# EAGLE board loa_v2 (EAGLE 5.12)
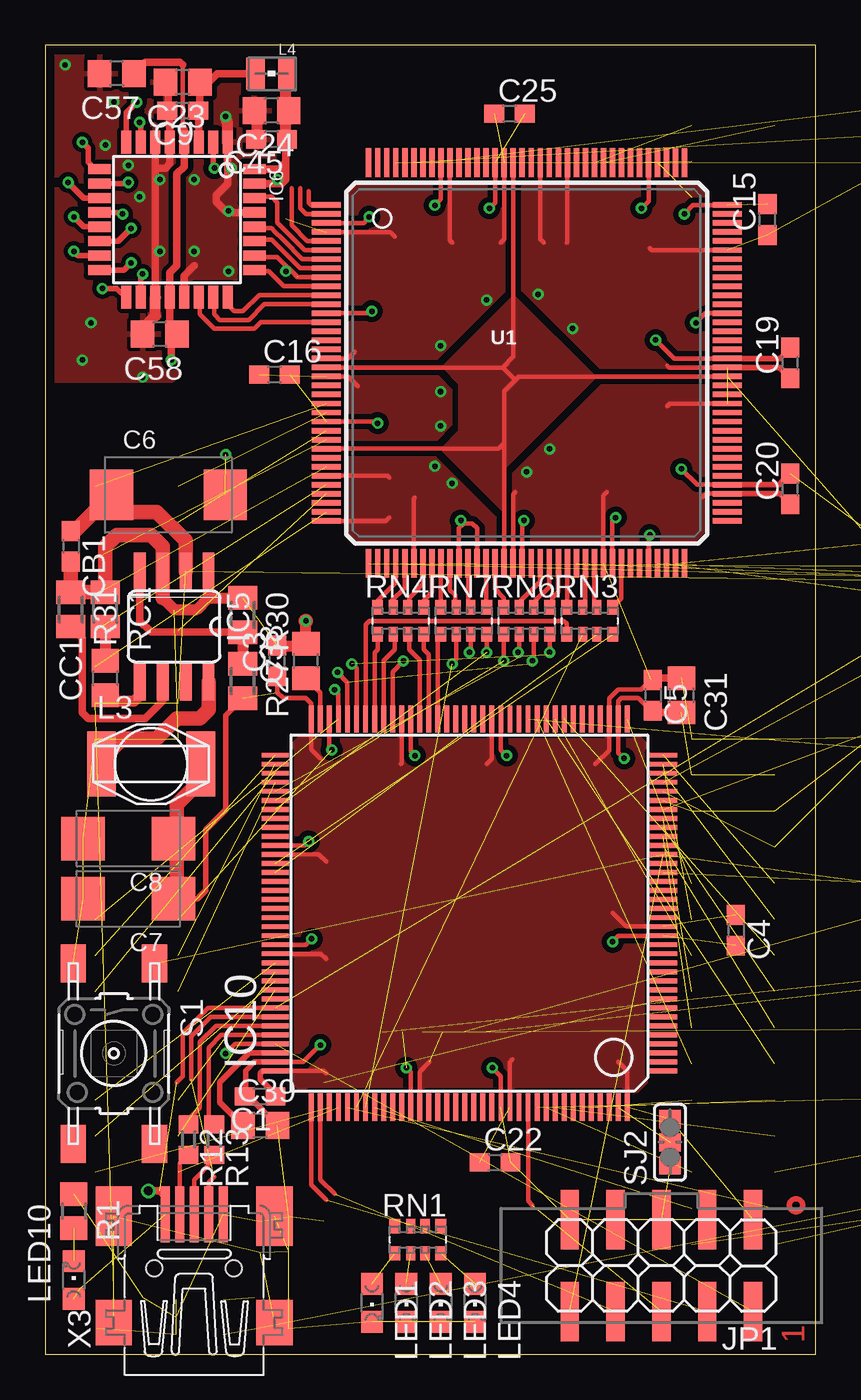
[diagram p9: board, top side]
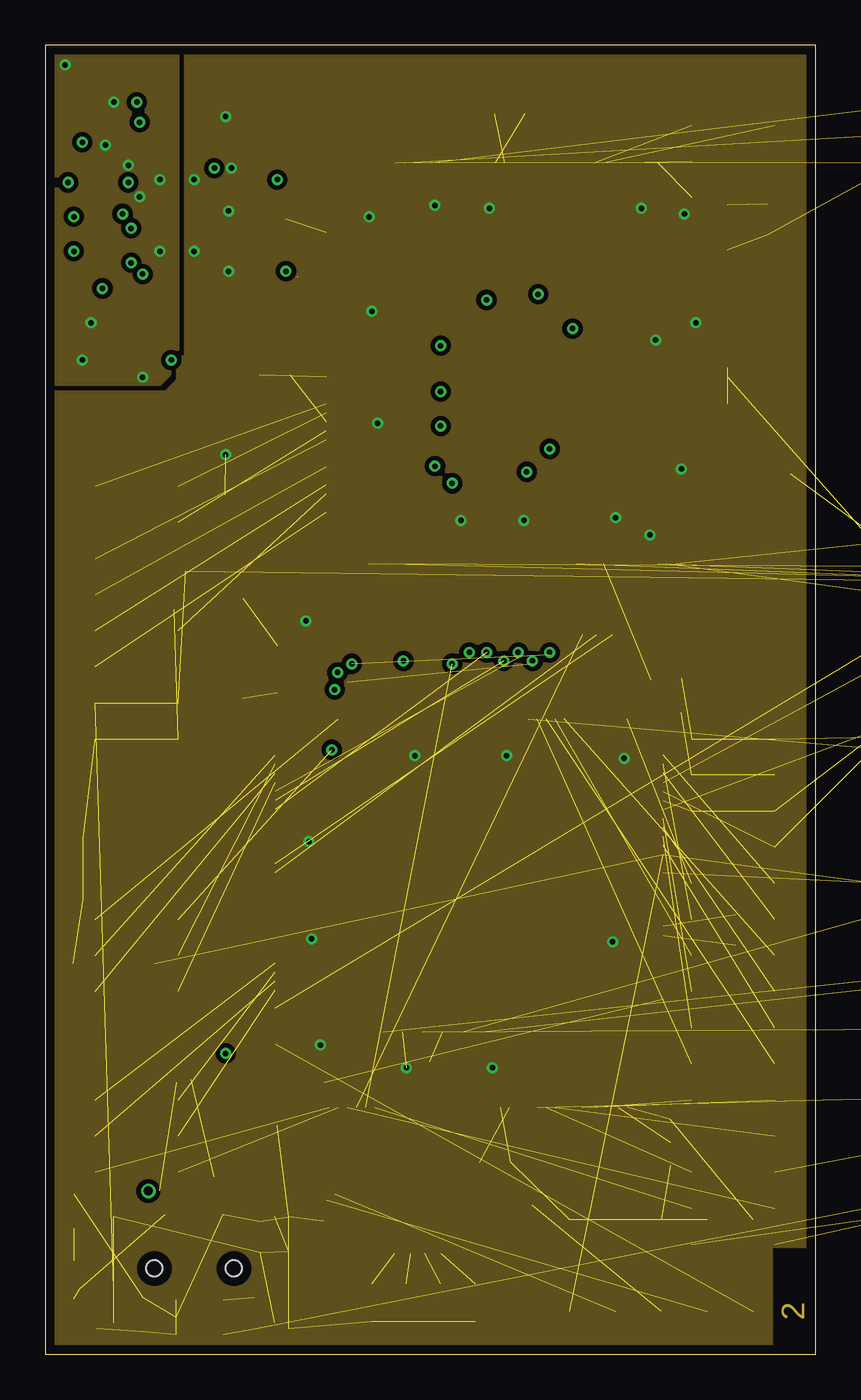
[diagram p10: board, inner layer GND]
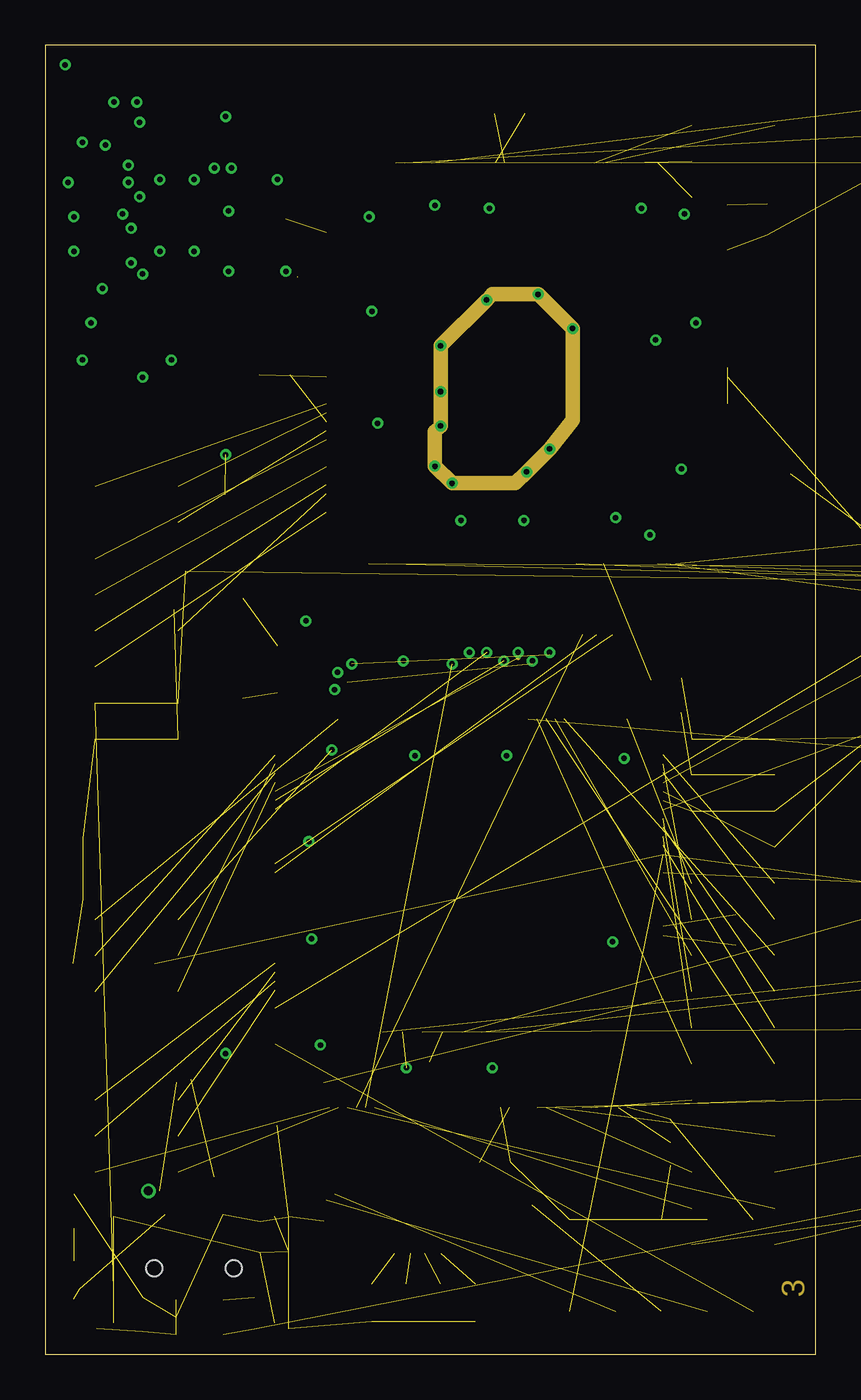
[diagram p11: board, inner layer Route15]
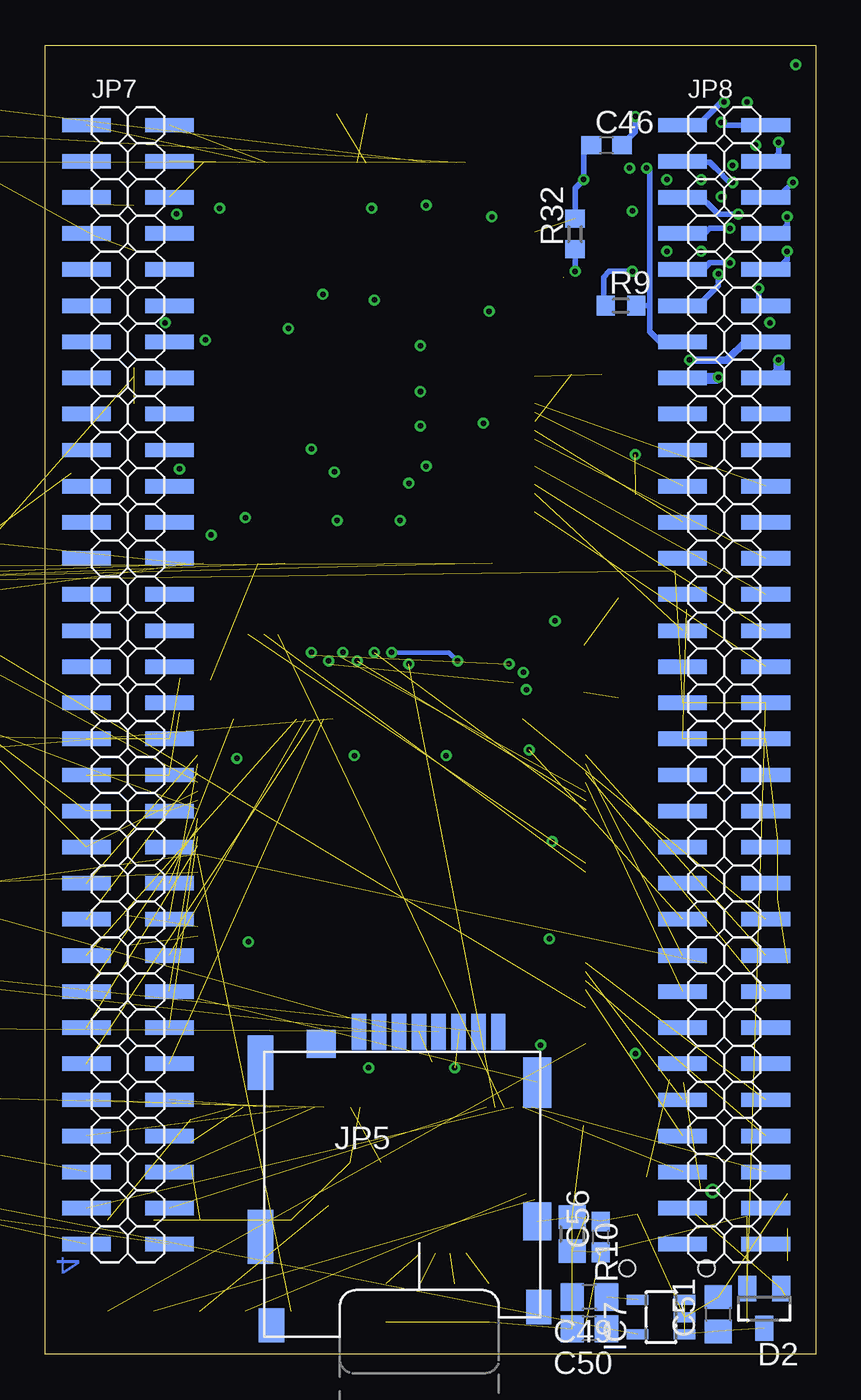
[diagram p12: board, bottom side, seen from below]

Size 42.68 x 72.54 mm. Coordinates in mm from the lower left corner, seen from the top.
Outline: 0,0 42.68,0 42.68,72.54 0,72.54 0,0
Copper layers (1+2*15+16): Top 0.035mm / dielectric 1.5mm / GND 0.035mm / dielectric 0.15mm / Route15 0.035mm / dielectric 0.2mm / Bottom 0.035mm
Design rules "PCB-POOL *": minimum track width 6mil, minimum drill 12mil, track to track 6mil, track to pad 6mil, pad to pad 6mil, via to via 6mil, smd to smd 6mil, copper to edge 20mil, drill to drill 8mil, minimum pad ring 8mil, minimum via ring 6mil, stop-mask expansion 12mil, vias tented up to drill 12mil, thermal gap 8mil

## Footprints (pad centres in the part's own frame; a part is rotated, then mirrored left to right if it is on the bottom)
C0603 = smd 1.1 x 1: 1 -0.85,0; 2 0.85,0
SMC_D = smd 2.4 x 2.8: + -3.15,0; - 3.15,0
SMC_C = smd 2.4 x 2.4: + -2.5,0; - 2.5,0
C0805 = smd 1.3 x 1.5: 1 -0.95,0; 2 0.95,0
SMB = smd 2.4 x 2.4: A 2.2,0; C -2.2,0
SOT23 = smd 1 x 1.4: 1 -0.95,-1.1; 2 0.95,-1.1; 3 0,1.1
SO14 = smd 0.66 x 2.032: 1 -3.81,-3.073; 2 -2.54,-3.073; 3 -1.27,-3.073; 4 0,-3.073; 5 1.27,-3.073; 6 2.54,-3.073; 7 3.81,-3.073; 8 3.81,3.073; 9 2.54,3.073; 10 1.27,3.073; 11 0,3.073; 12 -1.27,3.073; 13 -2.54,3.073; 14 -3.81,3.073
SO-08M = smd 0.6 x 2.2: 1 -1.905,-3.33; 2 -0.635,-3.33; 3 0.635,-3.33; 4 1.905,-3.33; 5 1.905,3.33; 6 0.635,3.33; 7 -0.635,3.33; 8 -1.905,3.33
SOT223 = smd 1.219 x 2.235: 1 -2.311,-3.099; 2 0,-3.099; 3 2.311,-3.099 | smd 3.6 x 2.2: 4 0,3.099
SO08 = smd 0.66 x 2.032: 1 -1.905,-3.073; 2 -0.635,-3.073; 3 0.635,-3.073; 4 1.905,-3.073; 5 1.905,3.073; 6 0.635,3.073; 7 -0.635,3.073; 8 -1.905,3.073
TQFP32-08 = smd 1.27 x 0.559: 1 -4.293,2.8; 2 -4.293,2; 3 -4.293,1.2; 4 -4.293,0.4; 5 -4.293,-0.4; 6 -4.293,-1.2; 7 -4.293,-2; 8 -4.293,-2.8; 17 4.293,-2.8; 18 4.293,-2; 19 4.293,-1.2; 20 4.293,-0.4; 21 4.293,0.4; 22 4.293,1.2; 23 4.293,2; 24 4.293,2.8 | smd 0.559 x 1.27: 9 -2.8,-4.293; 10 -2,-4.293; 11 -1.2,-4.293; 12 -0.4,-4.293; 13 0.4,-4.293; 14 1.2,-4.293; 15 2,-4.293; 16 2.8,-4.293; 25 2.8,4.293; 26 2,4.293; 27 1.2,4.293; 28 0.4,4.293; 29 -0.4,4.293; 30 -1.2,4.293; 31 -2,4.293; 32 -2.8,4.293
SOT23-5L = smd 0.55 x 1.2: 1 -0.95,-1.3; 2 0,-1.3; 3 0.95,-1.3; 4 0.95,1.3; 5 -0.95,1.3
SOIC-8 = smd 2.032 x 0.66: 1 -3.073,1.27; 2 -3.073,0; 3 -3.073,-1.27; 4 -3.073,-2.54; 5 3.073,-2.54; 6 3.073,-1.27; 7 3.073,0; 8 3.073,1.27
TQFP144 = smd 0.27 x 1.5: 1 -8.75,-10.75; 2 -8.25,-10.75; 3 -7.75,-10.75; 4 -7.25,-10.75; 5 -6.75,-10.75; 6 -6.25,-10.75; 7 -5.75,-10.75; 8 -5.25,-10.75; 9 -4.75,-10.75; 10 -4.25,-10.75; 11 -3.75,-10.75; 12 -3.25,-10.75; 13 -2.75,-10.75; 14 -2.25,-10.75; 15 -1.75,-10.75; 16 -1.25,-10.75; 17 -0.75,-10.75; 18 -0.25,-10.75; 19 0.25,-10.75; 20 0.75,-10.75; 21 1.25,-10.75; 22 1.75,-10.75; 23 2.25,-10.75; 24 2.75,-10.75; 25 3.25,-10.75; 26 3.75,-10.75; 27 4.25,-10.75; 28 4.75,-10.75; 29 5.25,-10.75; 30 5.75,-10.75; 31 6.25,-10.75; 32 6.75,-10.75; 33 7.25,-10.75; 34 7.75,-10.75; 35 8.25,-10.75; 36 8.75,-10.75; 73 8.75,10.75; 74 8.25,10.75; 75 7.75,10.75; 76 7.25,10.75; 77 6.75,10.75; 78 6.25,10.75; 79 5.75,10.75; 80 5.25,10.75; 81 4.75,10.75; 82 4.25,10.75; 83 3.75,10.75; 84 3.25,10.75; 85 2.75,10.75; 86 2.25,10.75; 87 1.75,10.75; 88 1.25,10.75; 89 0.75,10.75; 90 0.25,10.75; 91 -0.25,10.75; 92 -0.75,10.75; 93 -1.25,10.75; 94 -1.75,10.75; 95 -2.25,10.75; 96 -2.75,10.75; 97 -3.25,10.75; 98 -3.75,10.75; 99 -4.25,10.75; 100 -4.75,10.75; 101 -5.25,10.75; 102 -5.75,10.75; 103 -6.25,10.75; 104 -6.75,10.75; 105 -7.25,10.75; 106 -7.75,10.75; 107 -8.25,10.75; 108 -8.75,10.75 | smd 1.5 x 0.27: 37 10.75,-8.75; 38 10.75,-8.25; 39 10.75,-7.75; 40 10.75,-7.25; 41 10.75,-6.75; 42 10.75,-6.25; 43 10.75,-5.75; 44 10.75,-5.25; 45 10.75,-4.75; 46 10.75,-4.25; 47 10.75,-3.75; 48 10.75,-3.25; 49 10.75,-2.75; 50 10.75,-2.25; 51 10.75,-1.75; 52 10.75,-1.25; 53 10.75,-0.75; 54 10.75,-0.25; 55 10.75,0.25; 56 10.75,0.75; 57 10.75,1.25; 58 10.75,1.75; 59 10.75,2.25; 60 10.75,2.75; 61 10.75,3.25; 62 10.75,3.75; 63 10.75,4.25; 64 10.75,4.75; 65 10.75,5.25; 66 10.75,5.75; 67 10.75,6.25; 68 10.75,6.75; 69 10.75,7.25; 70 10.75,7.75; 71 10.75,8.25; 72 10.75,8.75; 109 -10.75,8.75; 110 -10.75,8.25; 111 -10.75,7.75; 112 -10.75,7.25; 113 -10.75,6.75; 114 -10.75,6.25; 115 -10.75,5.75; 116 -10.75,5.25; 117 -10.75,4.75; 118 -10.75,4.25; 119 -10.75,3.75; 120 -10.75,3.25; 121 -10.75,2.75; 122 -10.75,2.25; 123 -10.75,1.75; 124 -10.75,1.25; 125 -10.75,0.75; 126 -10.75,0.25; 127 -10.75,-0.25; 128 -10.75,-0.75; 129 -10.75,-1.25; 130 -10.75,-1.75; 131 -10.75,-2.25; 132 -10.75,-2.75; 133 -10.75,-3.25; 134 -10.75,-3.75; 135 -10.75,-4.25; 136 -10.75,-4.75; 137 -10.75,-5.25; 138 -10.75,-5.75; 139 -10.75,-6.25; 140 -10.75,-6.75; 141 -10.75,-7.25; 142 -10.75,-7.75; 143 -10.75,-8.25; 144 -10.75,-8.75
2X05SMD = smd 1.016 x 3.302: 1 -5.08,-2.54; 2 -5.08,2.54; 3 -2.54,-2.54; 4 -2.54,2.54; 5 0,-2.54; 6 0,2.54; 7 2.54,-2.54; 8 2.54,2.54; 9 5.08,-2.54; 10 5.08,2.54
SD_MOLEX_49225-0821 = smd 0.8 x 2: 1 -2.43,8.5; 2 -1.33,8.5; 3 -0.23,8.5; 4 0.87,8.5; 5 1.97,8.5; 6 3.07,8.5; 7 4.17,8.5; 8 5.27,8.5 | smd 1.4 x 1.9: 11 7.51,-6.75; 12 -7.29,-7.75 | smd 1.4 x 3: 13 -7.89,-2.85; 14 -7.89,6.8 | smd 1.6 x 1.55: 15 -4.53,7.825 | smd 1.55 x 2.8: SW1 7.435,5.7 | smd 1.55 x 2.1: SW2 7.435,-2
2X32M_SMD = smd 0.8 x 2.7: 1 -30,-2.3; 2 -30,2.3; 3 -28,-2.3; 4 -28,2.3; 5 -26,-2.3; 6 -26,2.3; 7 -24,-2.3; 8 -24,2.3; 9 -22,-2.3; 10 -22,2.3; 11 -20,-2.3; 12 -20,2.3; 13 -18,-2.3; 14 -18,2.3; 15 -16,-2.3; 16 -16,2.3; 17 -14,-2.3; 18 -14,2.3; 19 -12,-2.3; 20 -12,2.3; 21 -10,-2.3; 22 -10,2.3; 23 -8,-2.3; 24 -8,2.3; 25 -6,-2.3; 26 -6,2.3; 27 -4,-2.3; 28 -4,2.3; 29 -2,-2.3; 30 -2,2.3; 31 0,-2.3; 32 0,2.3; 33 2,-2.3; 34 2,2.3; 35 4,-2.3; 36 4,2.3; 37 6,-2.3; 38 6,2.3; 39 8,-2.3; 40 8,2.3; 41 10,-2.3; 42 10,2.3; 43 12,-2.3; 44 12,2.3; 45 14,-2.3; 46 14,2.3; 47 16,-2.3; 48 16,2.3; 49 18,-2.3; 50 18,2.3; 51 20,-2.3; 52 20,2.3; 53 22,-2.3; 54 22,2.3; 55 24,-2.3; 56 24,2.3; 57 26,-2.3; 58 26,2.3; 59 28,-2.3; 60 28,2.3; 61 30,-2.3; 62 30,2.3; 63 32,-2.3; 64 32,2.3
WE-KI_0805_B = smd 1.02 x 1.78: 1 -0.89,0; 2 0.89,0
L-PISG = smd 1.6 x 3.6: 1 -2.75,0; 2 2.75,0
CHIPLED_0805 = smd 1.2 x 1.2: A 0,-1.05; C 0,1.05
XO53 = smd 1.93 x 2.032: 1 -1.5,-1.7; 2 1.5,-1.7; 3 1.5,1.7; 4 -1.5,1.7
R0805 = smd 1.3 x 1.5: 1 -0.95,0; 2 0.95,0
R0603 = smd 1 x 1.1: 1 -0.85,0; 2 0.85,0
M0805 = smd 1.3 x 1.6: 1 -0.95,0; 2 0.95,0
EXB38V = smd 0.6 x 0.8: 1 -1.275,-0.75; 4 1.275,-0.75; 5 1.275,0.75; 8 -1.275,0.75 | smd 0.5 x 0.8: 2 -0.4,-0.75; 3 0.4,-0.75; 6 0.4,0.75; 7 -0.4,0.75
B3F-10XX-SMD = smd 2.1 x 1.4: P1 -5,2.25; P2 5,2.25; P3 -5,-2.25; P4 5,-2.25
SJ_2S = smd 1 x 1.2: 1 -1.286,0; 2 0,0; 3 1.286,0
SJS = smd 1 x 1.2: 1 -0.683,0; 2 0.683,0
TQ144 = smd 1.6 x 0.3: P1 -11.1,8.75; P2 -11.1,8.25; P3 -11.1,7.75; P4 -11.1,7.25; P5 -11.1,6.75; P6 -11.1,6.25; P7 -11.1,5.75; P8 -11.1,5.25; P9 -11.1,4.75; P10 -11.1,4.25; P11 -11.1,3.75; P12 -11.1,3.25; P13 -11.1,2.75; P14 -11.1,2.25; P15 -11.1,1.75; P16 -11.1,1.25; P17 -11.1,0.75; P18 -11.1,0.25; P19 -11.1,-0.25; P20 -11.1,-0.75; P21 -11.1,-1.25; P22 -11.1,-1.75; P23 -11.1,-2.25; P24 -11.1,-2.75; P25 -11.1,-3.25; P26 -11.1,-3.75; P27 -11.1,-4.25; P28 -11.1,-4.75; P29 -11.1,-5.25; P30 -11.1,-5.75; P31 -11.1,-6.25; P32 -11.1,-6.75; P33 -11.1,-7.25; P34 -11.1,-7.75; P35 -11.1,-8.25; P36 -11.1,-8.75; P73 11.1,-8.75; P74 11.1,-8.25; P75 11.1,-7.75; P76 11.1,-7.25; P77 11.1,-6.75; P78 11.1,-6.25; P79 11.1,-5.75; P80 11.1,-5.25; P81 11.1,-4.75; P82 11.1,-4.25; P83 11.1,-3.75; P84 11.1,-3.25; P85 11.1,-2.75; P86 11.1,-2.25; P87 11.1,-1.75; P88 11.1,-1.25; P89 11.1,-0.75; P90 11.1,-0.25; P91 11.1,0.25; P92 11.1,0.75; P93 11.1,1.25; P94 11.1,1.75; P95 11.1,2.25; P96 11.1,2.75; P97 11.1,3.25; P98 11.1,3.75; P99 11.1,4.25; P100 11.1,4.75; P101 11.1,5.25; P102 11.1,5.75; P103 11.1,6.25; P104 11.1,6.75; P105 11.1,7.25; P106 11.1,7.75; P107 11.1,8.25; P108 11.1,8.75 | smd 0.3 x 1.6: P37 -8.75,-11.1; P38 -8.25,-11.1; P39 -7.75,-11.1; P40 -7.25,-11.1; P41 -6.75,-11.1; P42 -6.25,-11.1; P43 -5.75,-11.1; P44 -5.25,-11.1; P45 -4.75,-11.1; P46 -4.25,-11.1; P47 -3.75,-11.1; P48 -3.25,-11.1; P49 -2.75,-11.1; P50 -2.25,-11.1; P51 -1.75,-11.1; P52 -1.25,-11.1; P53 -0.75,-11.1; P54 -0.25,-11.1; P55 0.25,-11.1; P56 0.75,-11.1; P57 1.25,-11.1; P58 1.75,-11.1; P59 2.25,-11.1; P60 2.75,-11.1; P61 3.25,-11.1; P62 3.75,-11.1; P63 4.25,-11.1; P64 4.75,-11.1; P65 5.25,-11.1; P66 5.75,-11.1; P67 6.25,-11.1; P68 6.75,-11.1; P69 7.25,-11.1; P70 7.75,-11.1; P71 8.25,-11.1; P72 8.75,-11.1; P109 8.75,11.1; P110 8.25,11.1; P111 7.75,11.1; P112 7.25,11.1; P113 6.75,11.1; P114 6.25,11.1; P115 5.75,11.1; P116 5.25,11.1; P117 4.75,11.1; P118 4.25,11.1; P119 3.75,11.1; P120 3.25,11.1; P121 2.75,11.1; P122 2.25,11.1; P123 1.75,11.1; P124 1.25,11.1; P125 0.75,11.1; P126 0.25,11.1; P127 -0.25,11.1; P128 -0.75,11.1; P129 -1.25,11.1; P130 -1.75,11.1; P131 -2.25,11.1; P132 -2.75,11.1; P133 -3.25,11.1; P134 -3.75,11.1; P135 -4.25,11.1; P136 -4.75,11.1; P137 -5.25,11.1; P138 -5.75,11.1; P139 -6.25,11.1; P140 -6.75,11.1; P141 -7.25,11.1; P142 -7.75,11.1; P143 -8.25,11.1; P144 -8.75,11.1
32005-201 = smd 3.1 x 0.5: 1 3,1.6; 2 3,0.8; 3 3,0; 4 3,-0.8; 5 3,-1.6 | smd 2.5 x 2: M1 -3,-4.45; M2 -3,4.45 | smd 3.3 x 2: M3 2.9,4.45; M4 2.9,-4.45 | hole 0.9: 0,2.2; 0,-2.2

## Placement (x,y rotation side)
C1  100n  [C0603]  11.91,14.29 180 top
C2  100n  [C0603]  54.93,30.32 270 top  (outside the outline)
C3  100n  [C0603]  12.86,38.42 90 top
C4  100n  [C0603]  38.26,23.49 270 top
C5  100n  [C0603]  33.66,36.51 270 top
C6  22µ  [SMC_D]  6.83,47.62 0 top
C7  22µ  [SMC_C]  4.6,25.24 180 top
C8  22µ  [SMC_C]  4.6,28.57 180 top
C9  100n  [C0603]  7.62,68.9 180 top
C10  10n  [C0603]  48.74,42.7 0 top  (outside the outline)
C11  10n  [C0603]  66.04,65.25 0 top  (outside the outline)
C12  10n  [C0603]  58.1,64.93 180 top  (outside the outline)
C13  10n  [C0603]  58.42,43.18 180 top  (outside the outline)
C14  100n  [C0603]  75.09,48.1 45 top  (outside the outline)
C15  100n  [C0603]  40.01,62.87 90 top
C16  100n  [C0603]  12.7,54.29 0 top
C17  100n  [C0603]  75.98,59.15 315 top  (outside the outline)
C18  100n  [C0603]  63.82,59.05 225 top  (outside the outline)
C19  100n  [C0603]  41.27,54.93 90 top
C20  100n  [C0603]  41.27,47.94 90 top
C21  100n  [C0603]  64.55,47.85 135 top  (outside the outline)
C22  100n  [C0603]  24.92,10.64 0 top
C23  1µ  [C0805]  7.62,70.48 180 top
C24  1µ  [C0805]  12.54,68.9 180 top
C25  100n  [C0603]  25.72,68.74 0 top
C26  100n  [C0603]  70.01,47.62 90 top  (outside the outline)
C27  100n  [C0603]  58.1,66.2 180 top  (outside the outline)
C28  100n  [C0603]  66.04,66.52 0 top  (outside the outline)
C29  100n  [C0603]  58.42,40.64 180 top  (outside the outline)
C30  100n  [C0603]  48.74,41.43 0 top  (outside the outline)
C31  4u7  [C0805]  35.24,36.51 270 top
C32  1n  [C0603]  47.62,38.1 270 top  (outside the outline)
C33  100n  [C0603]  56.36,11.11 90 top  (outside the outline)
C34  100n  [C0805]  87.63,13.18 0 top  (outside the outline)
C35  1µ  [C0805]  49.37,38.26 270 top  (outside the outline)
C36  1n  [C0603]  51.28,38.1 270 top  (outside the outline)
C37  1µ  [C0805]  53.98,39.05 0 top  (outside the outline)
C38  2u2  [C0805]  14.45,38.42 90 top
C39  2u2  [C0805]  11.91,12.7 0 top
C44  100n  [C0603]  51.28,34.29 0 top  (outside the outline)
C45  100n  [C0603]  12.54,67.31 180 top
C46  100n  [C0603]  11.59,66.99 0 bottom
C47  4µ7  [C0805]  73.34,42.39 270 bottom  (outside the outline)
C48  1µ  [C0805]  73.34,38.97 90 bottom  (outside the outline)
C49  N.B.  [C0805]  12.54,3.17 180 bottom
C50  2µ2  [C0805]  12.54,1.43 180 bottom
C51  1µ  [C0805]  5.4,2.22 90 bottom
C52  22µ  [SMC_C]  67.31,27.15 0 bottom  (outside the outline)
C53  22µ  [SMC_C]  72.87,33.18 90 bottom  (outside the outline)
C54  100n  [C0603]  66.99,24.61 0 bottom  (outside the outline)
C55  100n  [C0603]  66.99,23.34 0 bottom  (outside the outline)
C56  10n  [C0603]  11.91,6.51 90 bottom
C57  470n  [C0805]  3.97,70.96 180 top
C58  470n  [C0805]  6.35,56.51 180 top
CB1  100n  [C0603]  1.43,44.77 270 top
CC1  6n8  [C0805]  3.33,37.47 90 top
D1  MURS 140  [SMB]  59.21,44.93 90 bottom  (outside the outline)
D2  BAT54C  [SOT23]  2.86,2.54 180 bottom
IC2  74AC02D  [SO14]  86.68,40.96 90 bottom  (outside the outline)
IC3  AT45DB081D-SU  [SO-08M]  87,21.59 0 top  (outside the outline)
IC4  MCP1825S-1202E/DB  [SOT223]  67.94,40.64 270 bottom  (outside the outline)
IC5  NCP3170  [SO08]  7.14,40.32 180 top
IC6  AD7266SU  [TQFP32-08]  7.3,62.87 270 top
IC7  MIC5205  [SOT23-5L]  8.57,2.06 90 bottom
IC8  MCP2551SN  [SOIC-8]  61.28,11.43 0 top  (outside the outline)
IC10  [TQFP144]  23.5,24.45 90 top
JP1  CORTEX_JTAGS  [2X05SMD]  34.13,4.92 180 top
JP5  SD_DETECT  [SD_MOLEX_49225-0821]  22.86,9.37 0 bottom
JP7  right  [2X32M_SMD]  38.1,38.1 270 bottom
JP8  left  [2X32M_SMD]  5.08,38.1 270 bottom
L1  0,68u  [WE-KI_0805_B]  54.93,43.81 270 top  (outside the outline)
L3  4µ7  [L-PISG]  5.87,32.7 0 top
L4  0,68u  [WE-KI_0805_B]  12.54,70.96 180 top
LED1  Red  [CHIPLED_0805]  18.1,2.86 180 top
LED2  Red  [CHIPLED_0805]  20,2.86 180 top
LED3  Red  [CHIPLED_0805]  21.91,2.86 180 top
LED4  Red  [CHIPLED_0805]  23.81,2.86 180 top
LED5  Red  [CHIPLED_0805]  48.42,66.04 270 top  (outside the outline)
LED6  Red  [CHIPLED_0805]  48.42,67.94 270 top  (outside the outline)
LED7  Red  [CHIPLED_0805]  48.42,69.85 270 top  (outside the outline)
LED8  Red  [CHIPLED_0805]  48.42,71.75 270 top  (outside the outline)
LED9  Green  [CHIPLED_0805]  81.6,39.05 180 top  (outside the outline)
LED10  Blue  [CHIPLED_0805]  1.59,4.13 0 top
LED11  Red  [CHIPLED_0805]  80.01,55.88 0 top  (outside the outline)
LED12  Green  [CHIPLED_0805]  87.63,55.88 0 top  (outside the outline)
Q1  25.000  [XO53]  75.56,26.35 180 bottom  (outside the outline)
Q2  50.000  [XO53]  57.78,69.85 270 top  (outside the outline)
R1  820  [R0805]  1.59,7.94 270 top
R2  100k  [R0805]  66.52,31.75 180 bottom  (outside the outline)
R4  10k  [R0805]  78.11,21.91 180 bottom  (outside the outline)
R5  10k  [R0603]  77.47,41.91 0 top  (outside the outline)
R6  10k  [R0603]  82.55,41.91 0 top  (outside the outline)
R7  10k  [R0603]  87.63,41.91 0 top  (outside the outline)
R8  10k  [R0603]  92.71,41.91 0 top  (outside the outline)
R9  10k  [R0603]  10.79,58.1 0 bottom
R10  1M  [R0805]  13.49,6.67 270 bottom
R11  330  [R0603]  90.17,49.53 0 top  (outside the outline)
R12  22  [R0603]  7.94,11.91 270 top
R13  22  [R0603]  9.37,11.91 270 top
R18  470  [R0805]  51.91,66.04 180 top  (outside the outline)
R19  470  [R0805]  51.91,67.94 180 top  (outside the outline)
R20  470  [R0805]  51.91,69.85 180 top  (outside the outline)
R21  470  [R0805]  51.91,71.75 180 top  (outside the outline)
R22  330  [R0805]  83.5,39.05 90 top  (outside the outline)
R23  470  [R0805]  66.67,11.43 90 top  (outside the outline)
R24  330  [R0603]  64.77,41.91 0 top  (outside the outline)
R25  330  [R0603]  71.12,41.91 0 top  (outside the outline)
R26  10k  [M0805]  66.52,29.84 180 bottom  (outside the outline)
R27  24k9  [M0805]  10.95,37.31 270 top
R28  10k  [M0805]  71.12,23.18 0 bottom  (outside the outline)
R29  10k  [M0805]  87.63,15.08 180 top  (outside the outline)
R30  8k06  [M0805]  10.95,40.96 270 top
R31  10k  [M0805]  1.43,41.27 270 top
R32  10k  [R0603]  13.34,62.07 90 bottom
R33  120  [R0805]  63.02,14.61 0 top  (outside the outline)
RC1  4k99  [M0805]  3.33,41.27 270 top
RN1  33  [EXB38V]  20.64,6.35 0 top
RN3  33  [EXB38V]  30.16,40.64 0 top
RN4  33  [EXB38V]  19.68,40.64 0 top
RN6  33  [EXB38V]  26.67,40.64 0 top
RN7  33  [EXB38V]  23.18,40.64 0 top
S1  Reset  [B3F-10XX-SMD]  3.81,16.67 270 top
SJ2  [SJ_2S]  34.61,11.75 90 top
SJ3  [SJ_2S]  49.05,35.72 0 top  (outside the outline)
SJ5  [SJS]  80.8,32.86 270 bottom  (outside the outline)
U1  6SLX9TQG144  [TQ144]  26.67,54.93 0 top
U$1  [LOGO]  3.17,78.42 0 top  (outside the outline)
X3  MINI-USB  [32005-201]  8.25,4.76 90 top

## Tracks (layer width: path | path; a pad name or v marks a point on that pad's centre or on a via)
!ADC_CS  (via drill 0.3)  (1 unrouted)
  Top 0.254: U1.P9 13.98,59.68 12.86,60.8 11.66,60.8 IC6.26 | v13.34,60.01 13.65,60.01 | 13.65,60.01 | 13.65,60.01 13.97,59.69
  Bottom 0.305: v13.34,60.01 13.34,60.64 R32.1
!RESET  (3 unrouted)
+3V3  (via drill 0.3)  (50 unrouted)
  Top 0.254: U1.P20 16.78,54.18 17.3,53.66 | U1.P18 16.76,55.18 17.14,55.56 | U1.P4 19.1,62.18 19.37,61.91 | U1.P135 22.42,61.72 22.54,61.59 | U1.P129 25.42,61.77 25.24,61.59 | U1.P125 27.42,61.8 27.62,61.59 | U1.P122 28.92,61.62 28.89,61.59 | U1.P103 33.6,61.18 33.5,61.28 | U1.P76 36.62,47.68 36.35,47.47 | U1.P86 34.58,52.68 34.45,52.55 | U1.P90 34.54,54.68 34.45,54.77 | U1.P63 30.92,47.59 31.11,47.78 | U1.P53 25.92,47.67 26.04,47.78 | U1.P42 20.42,47.41 20.48,47.47 | U1.P36 18.87,46.18 19.05,46.35 | U1.P31 18.95,48.68 19.05,48.58 | IC10.62 19.75,32.76 19.68,32.7 | IC10.52 24.75,33 24.45,32.7 | 30.48,32.7 31.25,33.47 IC10.39 31.25,36.33 31.75,36.83 33.02,36.83 33.55,37.36 C5.1 | IC10.108 15.42,15.7 15.56,15.56 | IC10.95 15.27,22.2 15.56,21.91 | IC10.121 20.75,15.66 21.27,16.19 | IC10.131 25.75,16.16 25.88,16.35 | IC10.144 32.24,15.7 31.75,16.19 | IC10.84 15.16,27.7 15.56,27.3 | IC10.17 32.18,23.7 31.43,24.45 | 15.24,33.02 14.74,33.52 IC10.72 14.74,36.05 14.45,36.35 13.18,36.35 12.86,36.67 12.86,37.41 C3.1
  Top 0.305: C7.+ 8.41,25.24 8.89,25.72 8.89,29.05 10,30.16 10,35.4 R27.2 | C1.1 12.7,14.61 12.54,14.61 | 12.54,14.61 11.91,15.24 11.91,15.56 12.05,15.7 IC10.108 | 12.54,14.61 | U1.P76 40.69,47.68 C20.1 | U1.P90 40.67,54.68 C19.1 | IC6.31 12.64,64.86 v12.86,65.09
  Top 0.406: IC6.31 13.11,64.86 13.34,65.09 13.34,65.61 13.28,65.67 13.34,65.72 13.34,66.04 | 13.34,66.04 13.34,67.25 C45.1 | IC6.32 12.96,65.67 13.34,66.04 | C5.1 33.71,37.36 33.81,37.47 C31.1
  Top 0.61: 13.34,69.05 13.34,67.47 C45.1 13.34,67.41 | 13.34,69.05 C24.1 13.34,69.05 | 13.34,69.05 13.34,70.84
  Top 0.813: L3.2 8.62,31.8 7.3,30.48 7.3,28.46 C8.+ 7.3,28.26 7.3,25.12 C7.+ | 13.34,70.84 L4.1
  Route15 0.813: v21.91,51.44 v21.91,53.34 v21.91,55.88 v24.45,58.42 24.77,58.74 v27.3,58.74 v29.21,56.83 29.21,51.75 v27.94,50.16 v26.67,48.9 26.04,48.26 v22.54,48.26 v21.59,49.21 21.59,51.12 v21.91,51.44
  Bottom 0.305: R32.2 13.34,64.61 v12.86,65.09 12.86,66.52 12.44,66.94 C46.1
  pour Top (isolate 0.305, rank 6): 17.46,45.09 16.83,45.72 16.83,64.14 17.46,64.77 35.88,64.77 36.51,64.14 36.51,45.72 35.88,45.09
  pour Top (isolate 0.305): 14.29,14.61 13.65,15.24 13.65,33.66 14.29,34.29 32.7,34.29 33.34,33.66 33.34,15.24 32.7,14.61
+5V  (3 unrouted)
ADC_A0
  Top 0.254: U1.P10 13.21,59.18 12.38,60.01 11.91,60.01 11.85,60.06 IC6.25
ADC_A1
  Top 0.254: U1.P11 11.85,58.68 10.95,57.78 10.48,57.78 10.16,58.1 10.16,58.52 IC6.24
ADC_A2
  Top 0.254: U1.P12 12.14,58.18 11.27,57.31 9.68,57.31 9.37,57.63 9.37,58.51 IC6.23
ADC_CLK
  Top 0.254: U1.P8 14.12,60.18 12.54,61.75 11.68,61.75 IC6.27
ADC_DOUTA
  Top 0.254: U1.P6 14.39,61.18 12.86,62.71 12.86,63.82 12.54,64.14 11.66,64.14 IC6.30
ADC_DOUTB
  Top 0.254: U1.P7 14.25,60.68 13.18,61.75 12.7,62.23 12.54,62.39 11.68,62.39 IC6.28
ADC_SGL_DIFF
  Top 0.254: U1.P14 11.93,57.18 11.59,56.83 9.37,56.83 8.57,57.63 8.57,58.5 IC6.22
AGND  (via drill 0.3)
  Top 0.406: IC6.19 IC6.6 6.11,67.11 6.11,65.72 6.67,65.72 6.9,65.96 IC6.5 6.9,68.77 C9.2 6.83,68.9 6.83,70.33 C23.2
  Top 0.61: IC6.19 6.1,57.54 5.4,56.83 | C58.2 5.4,56.83 | 5.4,56.83 5.56,56.84
  Bottom 0.61: JP8.15 5.43,54.1 v5.4,54.13 | JP8.16 2.42,54.1 2.06,54.45 v2.06,55.09
  other vias: 4.6,65.88 6.35,61.12 6.35,65.09 2.54,57.15 3.33,66.99 1.11,71.44 3.81,69.37 5.24,64.14
  pour Top (isolate 0.254, rank 5): -1.27,73.34 7.3,73.34 7.3,54.29 6.99,53.98 -1.27,53.98
  pour GND (isolate 0.254, rank 5): -1.91,74.3 7.3,74.3 7.3,54.77 6.35,53.82 -1.91,53.82
CAN-H  (1 unrouted)
CAN-L  (1 unrouted)
CCLK  (1 unrouted)
D0  (1 unrouted)
D1  (1 unrouted)
D2  (1 unrouted)
D3  (via drill 0.3)  (1 unrouted)
  Top 0.254: RN7.2 22.78,38.5 v22.54,38.26
D4
  Top 0.254: IC10.58 21.75,39.73 RN7.1
D5
  Top 0.254: IC10.59 21.25,38.76 20.95,39.05 RN4.4
  Top 0.305: RN4.4
D6
  Top 0.254: IC10.60 20.75,38.47 20.16,39.05 20.16,39.81
  Top 0.305: 20.16,39.81 RN4.3
D7  (via drill 0.3)
  Top 0.254: IC10.63 19.25,37.82 v19.84,38.42 | RN7.3 23.58,38.98 v23.5,38.89
  Bottom 0.254: v23.5,38.89 20.32,38.89 v19.84,38.42
D8
  Top 0.254: IC10.64 18.75,38.43 19.37,39.05 19.37,39.81
  Top 0.305: 19.37,39.81 RN4.2
D9
  Top 0.254: IC10.65 18.25,38.88 18.41,39.05 RN4.1
  Top 0.305: RN4.1
D10
  Top 0.254: IC10.66 17.75,40.45 17.94,40.64 28.73,40.64 28.89,40.48 RN3.1
D11  (via drill 0.3)  (1 unrouted)
  Top 0.254: IC10.67 17.25,38 v16.99,38.26 | RN6.4 27.95,39.06 v27.94,38.89
  Route15 0.254: v27.94,38.89 27.94,38.73
D12  (via drill 0.3)  (1 unrouted)
  Top 0.254: IC10.68 16.75,37.23 v16.19,37.78 | RN6.3 27.07,38.5 v26.99,38.42
  Route15 0.254: v26.99,38.42 26.99,38.26
D13  (via drill 0.3)  (1 unrouted)
  Top 0.254: RN6.2 26.27,39.13 v26.19,38.89
  Route15 0.254: v26.19,38.89 26.19,38.58
D14  (via drill 0.3)  (1 unrouted)
  Top 0.254: RN6.1 25.39,39.06 v25.4,38.42
D15  (via drill 0.3)  (1 unrouted)
  Top 0.254: RN7.4 24.45,39.22 v24.45,38.89
DONE  (3 unrouted)
FLASH_CS  (1 unrouted)
GND  (via drill 0.3)  (69 unrouted)
  Top 0.254: U1.P25 18.33,51.68 v18.41,51.59 | U1.P13 17.99,57.68 v18.1,57.78 | U1.P3 17.65,62.68 v17.94,63.02 | U1.P136 21.92,63.99 v21.59,63.66 | U1.P130 24.92,63.81 v24.61,63.5 | U1.P113 33.42,63.9 v33.02,63.5 | U1.P108 35.86,63.68 v35.4,63.18 | U1.P96 36.56,57.68 v36.04,57.15 | U1.P91 34.83,55.18 v33.81,56.2 | v33.81,56.2 | U1.P77 36.12,48.18 v35.24,49.05 | U1.P68 33.42,45.33 v33.5,45.4 | U1.P64 31.42,46.18 v31.59,46.35 | U1.P54 26.42,46.1 v26.51,46.2 | U1.P49 23.92,45.77 23.65,46.04 23.18,46.04 | U1.P47 22.92,45.78 23.18,46.04 | 23.18,46.04 | 23.18,46.04 v23.02,46.2 | IC10.83 14.39,28.2 v14.61,28.42 | IC10.94 14.44,22.7 v14.76,23.02 | IC10.61 20.25,33.41 v20.48,33.18 | IC10.51 25.25,33.49 v25.56,33.18 | v32.07,33.02 31.75,33.33 IC10.38 31.75,36.2 31.91,36.35 32.86,36.35 33.55,35.66 C5.2 | IC10.16 31.73,23.2 v31.43,22.86 | IC10.120 20.25,15.64 v20,15.88 | IC10.107 14.28,16.2 v15.24,17.14 | IC10.130 25.25,15.39 v24.77,15.88
  Top 0.305: IC10.107 11.59,16.2 11.11,15.72 11.11,14.66 C1.2 11.27,14.29 C39.2 | U1.P77 40.66,48.18 C20.2 | U1.P91 40.67,55.18 C19.2
  Top 0.406: IC6.29 10.08,63.27 9.47,63.88 9.47,64.24 10.1,64.87 IC6.1 | IC6.21 7.7,59.77 8.26,60.33 | C5.2 33.66,35.56 C31.2
  Top 0.61: RC1.1 | 9.05,41.91 R30.1 | 9.05,41.91 9.05,42.55 IC5.1 | 9.05,41.91 8.41,41.27 7.14,41.27 6.51,41.91 | IC6.1 10.1,68.2 v10,68.58 | C45.2 11.75,67.31 11.75,68.89 C24.2 | 14.45,39.21 12.96,39.21 | C38.2 v14.45,40.64
  Top 0.813: R31.1 RC1.1 3.33,44.77 3.97,45.4 5.87,45.4 6.51,44.77 IC5.3 6.51,41.91 | R31.1 | R31.1 CB1.2 | C38.2 14.45,39.21 | 14.45,39.21 | 12.96,39.21 C3.2 | v14.45,40.64
  Bottom 0.305: R9.1 11.75,58.1 11.75,59.69 11.43,60.01 v10.16,60.01 | v10,68.58 10,67.73 C46.2
  other vias: 10.16,63.34 10.32,65.72 10,49.85 8.26,61.12 8.26,65.09
  pour GND (isolate 0.254, rank 6): -1.27,73.66 43.18,73.66 43.18,6.03 40.16,6.03 40.16,-1.27 -1.27,-1.27
  pour Top (isolate 0.305, rank 6): 8.57,72.39 12.7,72.39 12.7,66.36 11.43,65.09 11.43,59.37 10.79,58.74 7.62,58.74 7.62,71.44
GNDA  (9 unrouted)
INIT_B  (1 unrouted)
M0  (1 unrouted)
M1  (1 unrouted)
N$1  (1 unrouted)
N$2
  Top 0.254: U1.P65 31.92,41.87 RN3.5
N$3
  Top 0.254: U1.P62 30.42,41.53 RN3.6
N$5
  Top 0.254: U1.P61 29.92,41.55 RN3.7
N$6
  Top 0.254: U1.P59 28.92,41.42 RN3.8
N$7
  Top 0.254: U1.P58 28.42,42.23 28.1,41.91 28.1,41.54 RN6.5
N$8
  Top 0.254: U1.P57 27.92,42.52 27.15,41.75 27.15,41.47 RN6.6
N$9
  Top 0.254: U1.P56 27.42,42.82 26.35,41.75 26.35,41.47 RN6.7
N$10
  Top 0.254: U1.P51 24.92,42.39 25.4,41.91 RN6.8
N$11
  Top 0.254: U1.P50 24.42,41.42 RN7.5
N$12
  Top 0.254: U1.P48 23.42,41.55 RN7.6
N$13
  Top 0.254: U1.P46 22.42,42.35 22.7,42.07 22.7,41.47 RN7.7
N$14
  Top 0.254: U1.P45 21.92,41.41 RN7.8
N$15
  Top 0.254: U1.P44 21.42,42.22 20.95,41.75 RN4.5
N$16
  Top 0.254: X3.2 7.46,10.57 R12.2
N$17
  Top 0.254: X3.3 8.26,9.68 9.21,10.64 9.21,11.21 R13.2
N$18  (1 unrouted)
N$19  (1 unrouted)
N$20  (1 unrouted)
N$21  (1 unrouted)
N$22  (1 unrouted)
N$23  (1 unrouted)
N$24  (1 unrouted)
N$25  (1 unrouted)
N$26  (1 unrouted)
N$27
  Top 0.254: IC10.71 15.24,36.67 C38.1
N$28  (1 unrouted)
N$29
  Top 0.305: IC10.106 11.3,16.7 9.68,15.08 9.68,13.97 C39.1
N$30  (1 unrouted)
N$31  (1 unrouted)
N$33  (1 unrouted)
N$34  (1 unrouted)
N$35
  Top 0.254: U1.P41 19.92,42.46 19.21,41.75 19.21,41.47 RN4.7
N$36  (3 unrouted)
N$40  (1 unrouted)
N$42  (5 unrouted)
N$43  (3 unrouted)
N$44
  Top 0.254: U1.P43 20.92,42.67 20.16,41.91 20.16,41.47 RN4.6
N$45
  Top 0.254: U1.P40 19.42,42.76 18.41,41.75 RN4.8
N$47  (1 unrouted)
N$48  (1 unrouted)
N$49  (1 unrouted)
N$50  (1 unrouted)
N$51
  Top 0.61: RC1.2 CC1.2
N$52
  Top 0.61: CC1.1 3.65,36.2 4.92,36.2 5.24,36.51 IC5.5
N$53
  Top 0.813: L3.1 3.12,32.97 4.29,34.13 6.19,34.13 7.3,35.24 8.57,35.24 9.05,35.72 IC5.8
N$54
  Top 0.406: R30.2 5.87,40.01 5.24,40.64 IC5.4
  Top 0.61: R30.2 R27.1
N$55
  Top 0.406: L4.2 9.53,70.96 9.05,70.48 C23.1 8.57,68.9 C9.1 | IC6.3 8.5,68.86 C9.1 | C9.1 8.41,68.9
P1
  Top 0.254: U1.P1 14.74,63.68 14.61,63.82 14.61,64.45
P2
  Top 0.254: U1.P2 14.45,63.18 14.13,63.5 14.13,64.61
P5
  Top 0.254: U1.P5 14.52,61.68 13.65,62.55 13.65,64.61
P23  (1 unrouted)
P24  (1 unrouted)
P26  (1 unrouted)
P27  (1 unrouted)
P30  (1 unrouted)
P32  (1 unrouted)
P33  (1 unrouted)
P35  (1 unrouted)
P112  (1 unrouted)
P116  (1 unrouted)
P118  (1 unrouted)
P119  (1 unrouted)
P137  (1 unrouted)
P140  (1 unrouted)
P141  (1 unrouted)
PA0  (1 unrouted)
PA1  (1 unrouted)
PA2  (1 unrouted)
PA3  (1 unrouted)
PB0  (1 unrouted)
PB1  (1 unrouted)
PB2  (1 unrouted)
PB4  (1 unrouted)
PB5  (1 unrouted)
PB6  (1 unrouted)
PB8  (1 unrouted)
PB9  (1 unrouted)
PB10  (via drill 0.3)  (1 unrouted)
  Top 0.254: IC10.69 16.25,36.62 v16.03,36.83
PB11  (via drill 0.3)  (1 unrouted)
  Top 0.254: IC10.70 15.74,33.63 v15.88,33.5
PB12  (1 unrouted)
PB13  (1 unrouted)
PB14  (1 unrouted)
PB15  (1 unrouted)
PC0  (1 unrouted)
PC1  (1 unrouted)
PC2  (1 unrouted)
PC3  (1 unrouted)
PC4  (1 unrouted)
PC5  (1 unrouted)
PC6  (1 unrouted)
PC7  (1 unrouted)
PC8  (1 unrouted)
PC9  (1 unrouted)
PC10  (1 unrouted)
PC11  (1 unrouted)
PC12  (1 unrouted)
PD2  (1 unrouted)
PROGRAM_B  (3 unrouted)
PWR_ON
  Top 0.406: IC5.6 6.51,36.2 5.56,35.24 2.38,35.24 2.06,35.56 2.06,39.69 R31.2
REF_SEL  (via drill 0.3)
  Top 0.305: IC6.2 9.3,65.82 v9.37,65.72
  Bottom 0.305: JP8.13 8.63,56.1 9.21,56.67 9.21,58.1 | 9.21,58.1 9.21,65.56 v9.37,65.72 | 9.21,58.1 R9.2
  Bottom 0.406: v9.37,65.72
REFA  (via drill 0.3)
  Top 0.254: 7.62,67.94 7.62,71.44
  Top 0.406: 7.62,67.94 7.7,67.86 IC6.4 7.7,65.81 7.3,65.41 7.3,60.33 6.9,59.92 IC6.20 6.9,56.44 C58.1 6.99,56.36 6.99,55.4 v6.99,55.09 | 7.62,71.44 7.46,71.6 5.56,71.6 C57.1 | v6.99,55.09
  Bottom 0.406: v6.99,55.09 4.92,55.09 3.81,56.2 2.88,56.2 JP8.14
SD_CS  (1 unrouted)
SD_DETECT  (1 unrouted)
TCK  (1 unrouted)
  Top 0.254: IC10.109 14.74,9.38 15.56,8.57
TDI  (1 unrouted)
  Top 0.254: IC10.110 15.24,9.68 16.03,8.89
TDO  (1 unrouted)
  Top 0.254: IC10.133 26.75,8.5 26.99,8.26
TMS  (via drill 0.3)  (1 unrouted)
  Top 0.254: IC10.105 10.53,17.2 v10,16.67
UART3_CK  (1 unrouted)
UART3_RX  (1 unrouted)
UART3_TX  (2 unrouted)
USB_DM
  Top 0.254: IC10.103 9.47,18.2 8.57,17.3 8.57,13.65 7.62,12.7 7.62,12.76 R12.1
USB_DP
  Top 0.254: R13.1 9.37,12.7 9.05,13.02 9.05,16.99 9.76,17.7 IC10.104
USB_ID  (1 unrouted)
  Top 0.254: X3.4 9.05,9.53 9.37,9.84 | IC10.102 9.17,18.7 8.1,17.62 8.1,15.24
USB_VBUS  (via drill 0.5)  (4 unrouted)
  Top 0.254: IC10.101 9.04,19.2 7.62,17.78 7.62,15.4 7.3,15.08
  Top 0.406: X3.1 6.66,8.74 6.35,9.05 v5.71,9.05
VA1  (via drill 0.3)
  Top 0.305: IC6.7 5.3,68.04 v5.24,68.26
  Bottom 0.305: v5.24,68.26 5.08,68.1 3.26,68.1 JP8.2
VA2  (via drill 0.3)
  Top 0.305: IC6.8 4.5,68.8 v5.08,69.37
  Bottom 0.305: v5.08,69.37 5.24,69.37 6.51,68.1 JP8.1
VA3  (via drill 0.3)
  Top 0.305: IC6.9 2.76,65.67 2.38,66.04 2.38,66.83 v2.06,67.15
  Bottom 0.305: v2.06,67.15 2.06,66.52 2.38,66.2 2.7,66.2 2.68,66.2 JP8.4
VA4  (via drill 0.3)
  Top 0.305: IC6.10 4.51,64.86 v4.6,64.93
  Bottom 0.305: v4.6,64.93 4.76,64.93 5.56,65.72 5.87,66.04 7.32,66.04 JP8.3
VA5  (via drill 0.3)
  Top 0.305: IC6.11 2.13,64.06 v1.27,64.93
  Bottom 0.305: v1.27,64.93 1.91,64.29 2.22,64.29 2.75,64.29 JP8.6
VA6  (via drill 0.3)
  Top 0.305: IC6.12 4.21,63.27 v4.29,63.18
  Bottom 0.305: v4.29,63.18 5.4,63.18 6.03,63.82 6.35,64.14 6.67,64.14 6.62,64.14 JP8.5
VB1  (via drill 0.3)
  Top 0.305: IC6.18 5.3,59.63 v5.4,59.85
  Bottom 0.305: v5.4,59.85 5.4,59.21 6.51,58.1 JP8.11
VB2  (via drill 0.3)
  Top 0.305: IC6.17 4.45,58.57 3.97,59.05 v3.17,59.05
  Bottom 0.305: v3.17,59.05 3.17,58.49 JP8.12
VB3  (via drill 0.3)
  Top 0.305: IC6.16 4.34,60.06 v4.76,60.48
  Bottom 0.254: 7.31,60.17 JP8.9
  Bottom 0.305: 7.31,60.17 6.19,60.17 5.87,60.48 v4.76,60.48
VB4  (via drill 0.3)
  Top 0.305: IC6.15 1.84,60.87 v1.59,61.12
  Bottom 0.305: v1.59,61.12 1.59,60.64 2.06,60.17 2.71,60.17 JP8.10
VB5  (via drill 0.3)
  Top 0.305: IC6.14 4.04,61.66 v4.76,62.39
  Bottom 0.254: 7.35,62.07 JP8.7
  Bottom 0.305: v4.76,62.39 5.87,62.39 6.19,62.07 7.35,62.07
VB6  (via drill 0.3)
  Top 0.305: IC6.13 2.15,62.47 v1.59,63.02
  Bottom 0.305: v1.59,63.02 1.59,62.55 1.91,62.23 2.65,62.23 JP8.8
VCC  (4 unrouted)
  Top 0.61: CB1.1 1.59,45.56
  Top 0.813: IC5.2 7.78,45.09 6.19,46.67 4.63,46.67 C6.+ | 3.65,47.62 1.59,45.56
  Top 1.016: 3.65,47.62 C6.+
  Top 1.27: 3.65,47.62 3.97,47.62
VCCINT  (10 unrouted)
  Top 0.254: 25.42,50.48 U1.P52 | 25.42,50.48 25.42,53.36 26.04,53.98 | U1.P28 25.11,50.18 25.42,50.48 | 25.33,54.68 U1.P19 | 26.04,53.98 25.33,54.68 | U1.P128 25.92,55.27 25.33,54.68 | U1.P89 26.24,54.18 26.04,53.98
  pour Top: 25.4,49.21 30.32,54.13 30.32,54.13 25.96,58.5 22.15,54.69 22.15,54.69 23.02,53.82 23.02,51.12 22.07,50.16 25.4,46.83
VREF  (3 unrouted)
(copper drawn outside any net)
  shapes: Top circle x1

## Text on the board
Top: fg | R | 1
GND: 2
Route15: 3
Bottom: 4 | fabian | 11/2011